# EAGLE schematic untitled (EAGLE 9.3.0)
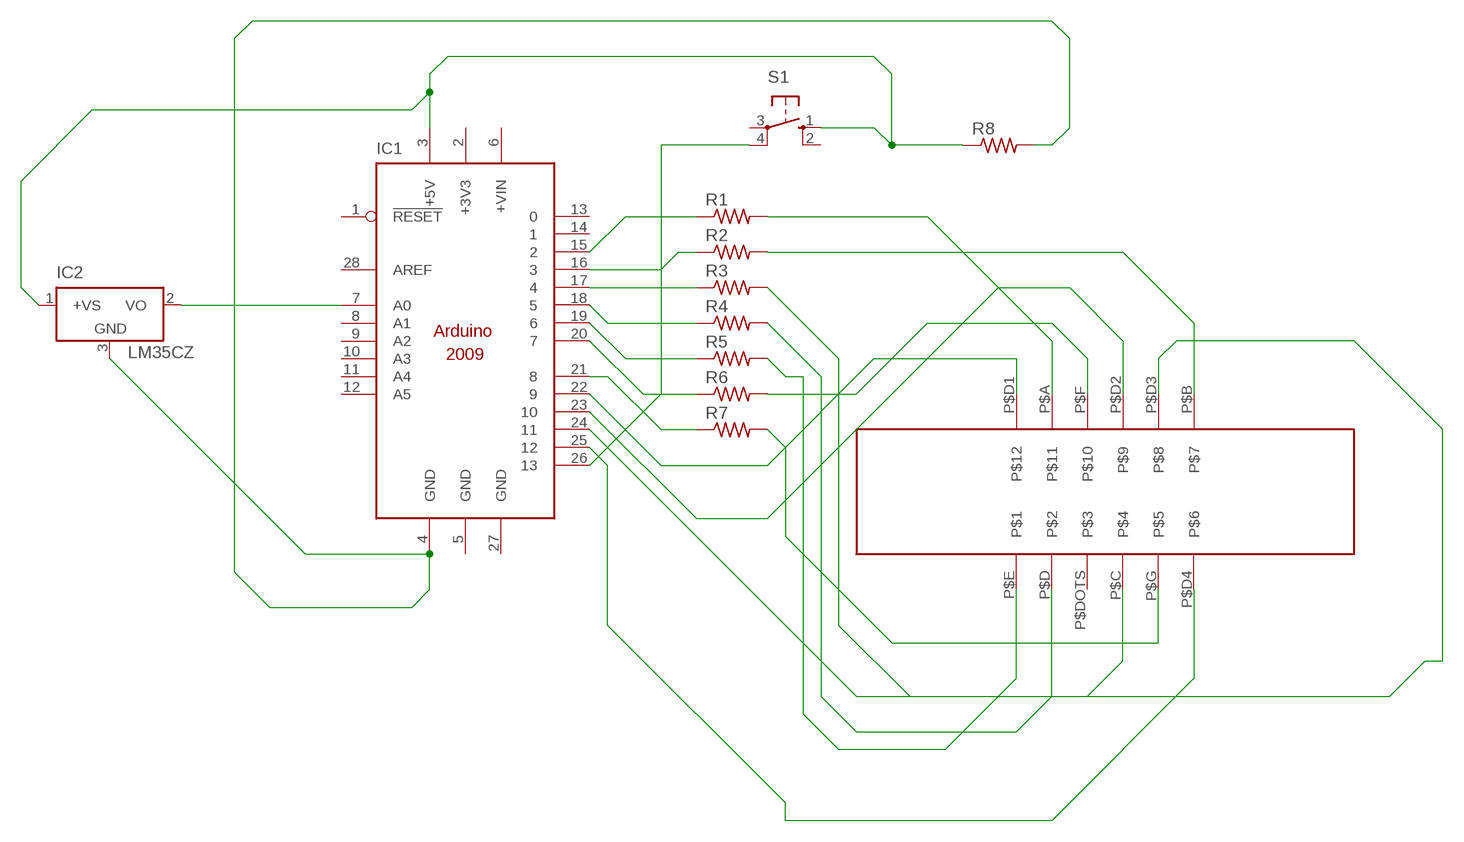
[diagram p0: schematic, sheet 1]

## Parts
IC1  ARDUINO2009_11  [ARDUINO2009_1]
IC2  LM35CZ  [TO92]
R1  R-US_0207/15  [0207/15]
R2  R-US_0207/15  [0207/15]
R3  R-US_0207/15  [0207/15]
R4  R-US_0207/15  [0207/15]
R5  R-US_0207/15  [0207/15]
R6  R-US_0207/15  [0207/15]
R7  R-US_0207/15  [0207/15]
R8  R-US_0207/15  [0207/15]
S1  10-XX  [B3F-10XX]
U$1  NFD-5642BX  [DISPLAY]

## Nets
N$1: IC1.21 R7.1
N$2: IC1.20 R6.1
N$3: IC1.19 R5.1
N$4: IC1.18 R4.1
N$5: IC1.17 R3.1
N$6: IC1.16 R2.1
N$7: IC1.15 R1.1
N$8: R1.2 U$1.P$A
N$9: R2.2 U$1.P$B
N$10: R3.2 U$1.P$C
N$11: R4.2 U$1.P$D
N$12: R5.2 U$1.P$E
N$13: R6.2 U$1.P$F
N$14: R7.2 U$1.P$G
N$15: IC1.22 U$1.P$D1
N$16: IC1.23 U$1.P$D2
N$17: IC1.24 U$1.P$D3
N$18: IC1.25 U$1.P$D4
N$19: IC1.3(+5V) IC2.1(+VS) R8.1 S1.1(S)
N$20: IC1.26 S1.4(P1)
N$21: IC1.4(GND) IC2.3(GND) R8.2
N$22: IC1.7(A0) IC2.2(VO)
Unconnected: IC1.1(!RESET) IC1.6(+VIN) IC1.8(A1) IC1.9(A2) IC1.10(A3) IC1.11(A4) IC1.12(A5) IC1.13 IC1.14 IC1.28(AREF) S1.2(S1) S1.3(P) U$1.P$DOTS

## Power pins joined to a net without a drawn wire
+3V3: IC1.2(+3V3)
GND: IC1.5(GND) IC1.27(GND)

## Library data of the parts
IC1 = arduino:ARDUINO2009_1: The Arduino Duemilanove ("2009") is a microcontroller board based on the ATmega168 or ATmega328. - 14 digital input/output pins (of which 6 can be used as PWM outputs) - 6 analog inputs, a 16 MHz crystal oscillator - USB connection - power jack - ISP header - reset button It contains everything needed to support the microcontroller; simply connect it to a computer with a USB cable or power it with a AC-to-DC adapter or battery to get started http://arduino.cc/en/Main/ArduinoBoardDuemilanove
IC2 = lm35:LM35: Single-Supply Centigrade Temperature Sensor Vout = (10mV/°C x Temp °C) +5mmmV Source: http://www.national.com/ds/LM/LM35.pdf
R1-R8 = rcl:R-US_: RESISTOR, American symbol; SPICEPREFIX: R
S1 = switch-omron:10-XX: OMRON SWITCH; MPN: B3F-1000; OC_FARNELL: 176432; OC_NEWARK: 36M3542
U$1 = NFD-5642Xx:NFD-5642BX